# Altium project DEV_BOARD_FULL.PrjPcb (part 2 of 2)

## Sheet Sch_mcu_brd_pwr.SchDoc
size A
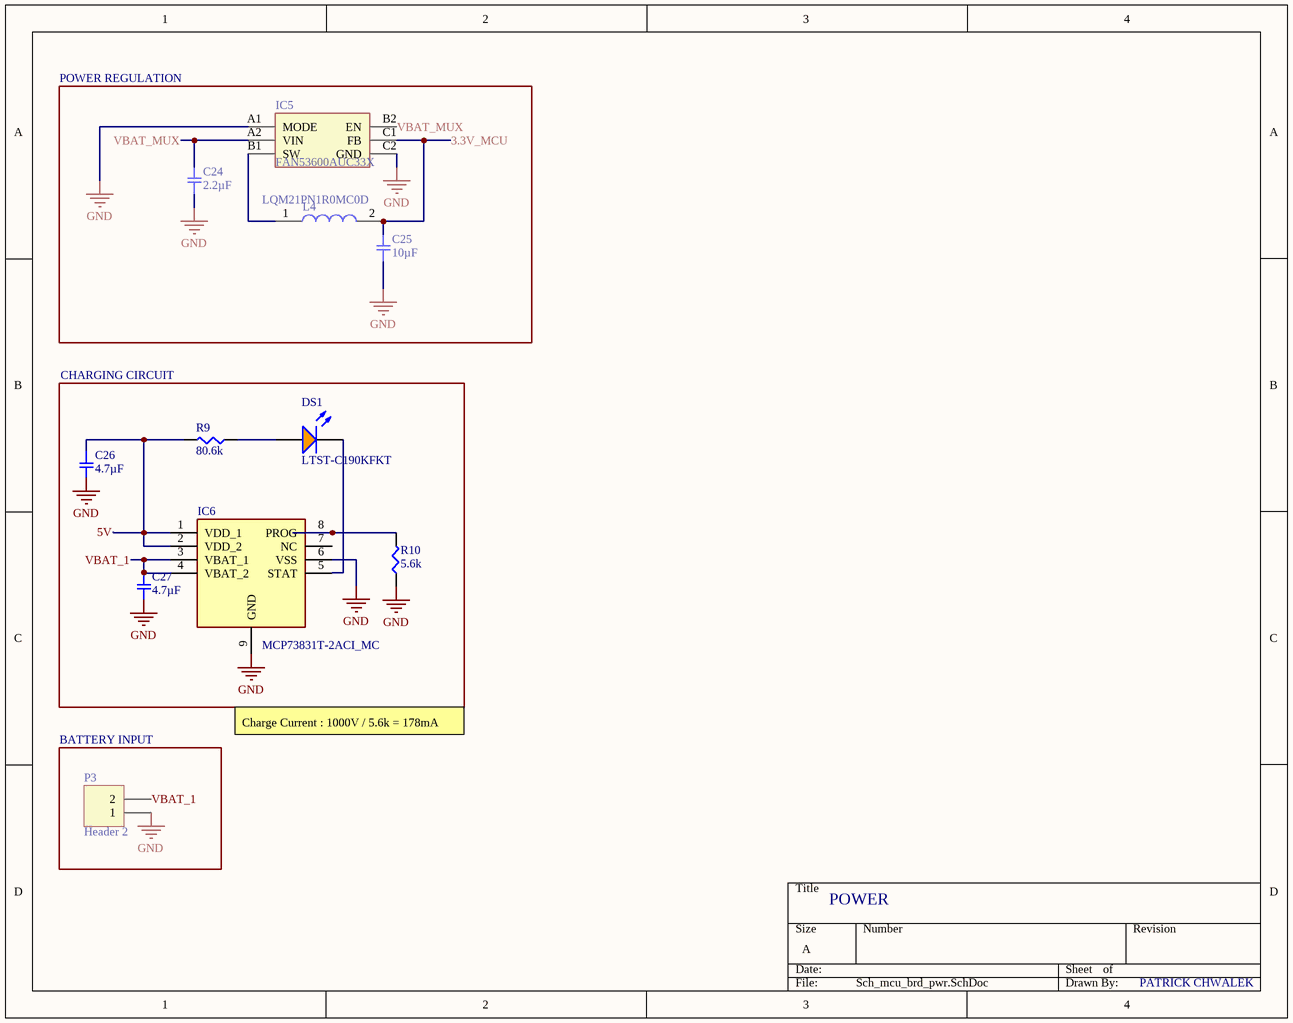
[diagram p7: Sch_mcu_brd_pwr.SchDoc]

### Parts
C24  2.2µF  [SMD-0402C]
C25  10µF  [SMD-0603C]
C26  4.7µF  [SMD-0402C]
C27  4.7µF  [SMD-0402C]
DS1  LTST-C190KFKT  [LTST-C190KFKT_V]
IC5  FAN53600AUC33X  [BGA6C40P2X3_86X116X62]
IC6  MCP73831T-2ACI_MC  [SON50P300X200X100-9N-D]
L4  LQM21PN1R0MC0D  [INDC2012X55N]
P3  Header 2  [HDR1X2]
R9  80.6k  [SMD-0402-RES]
R10  5.6k  [SMD-0402-RES]

### Blocks framed on the sheet
POWER REGULATION: C24 C25 IC5 L4
CHARGING CIRCUIT: C26 C27 DS1 IC6 R9 R10
BATTERY INPUT: P3

### Nets
3.3V_MCU: C25.2 IC5.C1(FB) L4.2
GND: C24.1 C25.1 C26.2 C27.2 IC5.A1(MODE) IC5.C2(GND) IC6.6(VSS) IC6.9(GND) P3.1 R10.1
5V: C26.1 IC6.1(VDD_1) IC6.2(VDD_2) R9.2
VBAT_1: C27.1 IC6.3(VBAT_1) IC6.4(VBAT_2) P3.2
VBAT_MUX: C24.2 IC5.A2(VIN) IC5.B2(EN)
NetDS1_1: DS1.1(A) R9.1
NetDS1_2: DS1.2(K) IC6.5(STAT)
NetIC5_B1: IC5.B1(SW) L4.1
NetIC6_8: IC6.8(PROG) R10.2

Not connected (* = marked no-connect by the designer): IC6 7(NC)

### Notes on the sheet
- Charge Current : 1000V / 5.6k = 178mA
- POWER
- PATRICK CHWALEK

### Library data of the parts
C24 = GRM155R60J225ME15D: CAP CER 2.2UF 6.3V X5R 0402; Manufacturer: Murata Electronics North America; Factory Stock: 0; Unit Price (USD): 0.15; Minimum Quantity: 1; Tolerance: ±20%; Datasheets: http://www.murata.com/~/media/webrenewal/support/library/catalog/products/capacitor/mlcc/c02e.pdf; Image: //media.digikey.com/Renders/Murata%20Renders/ZRB-SERIES-0402.jpg; Digi-Key Part Number: 490-4519-1-ND; Part Number: GRM155R60J225ME15D; Quantity Available: 911621; @ qty: 0; Packaging: Cut Tape (CT); Series: GRM; Part Status: Active; Value: 2.2µF; Voltage: 6.3V; Temperature Coefficient: X5R; Operating Temperature: -55°C ~ 85°C; Features: Derating Recommended; Ratings: -; Applications: General Purpose; Mounting Type: Surface Mount, MLCC; Package / Case: 0402 (1005 Metric); Size / Dimension: 0.039" L x 0.020" W (1.00mm x 0.50mm); Height - Seated (Max): -; Thickness (Max): 0.022" (0.55mm); Lead Spacing: -; Lead Style: -
C25 = GRM188R60J106ME47D: CAP CER 10UF 6.3V X5R 0603; Manufacturer: Murata Electronics North America; Factory Stock: 0; Unit Price (USD): 0.15; Minimum Quantity: 1; Tolerance: ±20%; Datasheets: http://www.murata.com/~/media/webrenewal/support/library/catalog/products/capacitor/mlcc/c02e.pdf; Image: //media.digikey.com/Renders/Murata%20Renders/ZRB-SERIES-0402.jpg; Digi-Key Part Number: 490-3896-1-ND; Part Number: GRM188R60J106ME47D; Quantity Available: 1578882; @ qty: 0; Packaging: Cut Tape (CT); Series: GRM; Part Status: Active; Value: 10µF; Voltage: 6.3V; Temperature Coefficient: X5R; Operating Temperature: -55°C ~ 85°C; Features: -; Ratings: -; Applications: General Purpose; Mounting Type: Surface Mount, MLCC; Package / Case: 0603 (1608 Metric); Size / Dimension: 0.063" L x 0.031" W (1.60mm x 0.80mm); Height - Seated (Max): -; Thickness (Max): 0.035" (0.90mm); Lead Spacing: -; Lead Style: -
C26 C27 = GRM153R60G475ME15D: CAP CER 4.7UF 4V X5R 0402; Manufacturer: Murata Electronics North America; Factory Stock: 0; Unit Price (USD): 0.27; Minimum Quantity: 1; Tolerance: ±20%; Datasheets: http://psearch.en.murata.com/capacitor/product/GRM153R60G475ME15%23.pdf; Image: //media.digikey.com/Renders/Murata%20Renders/ZRB-SERIES-0402.jpg; Digi-Key Part Number: 490-13231-1-ND; Part Number: GRM153R60G475ME15D; Quantity Available: 9100; @ qty: 0; Packaging: Cut Tape (CT); Series: GRM; Part Status: Active; Value: 4.7µF; Voltage: 4V; Temperature Coefficient: X5R; Operating Temperature: -55°C ~ 85°C; Features: -; Ratings: -; Applications: General Purpose; Mounting Type: Surface Mount, MLCC; Package / Case: 0402 (1005 Metric); Size / Dimension: 0.039" L x 0.020" W (1.00mm x 0.50mm); Height - Seated (Max): -; Thickness (Max): 0.013" (0.33mm); Lead Spacing: -; Lead Style: -
DS1 = CMP-1674-00008-1: LED Uni-Color Orange, 75 mW, 30 mA, -35 to 85 degC, 2-Pin SMD, RoHS, Tape and Reel; Resistance: 47 kohm; Power Rating: 100 mW; Case\Package: 0603; Tolerance: 1%; Voltage Rating (DC): 50 V; ComponentLink2URL: http://optoelectronics.liteon.com/upload/download/DS-22-99-0186/S_110_LTST-C190KFKT.pdf; Mount: Surface Mount; Pins: 2; Package Quantity: 5000; Max Operating Temperature: 155 degC; RoHSCompliant: true; PackageDescription: 2-Pin Surface Mount Device, Body 1.6 x 0.8 mm; Case Code (Metric): 1608; PackageReference: C190KFKT; Height: 0.45 mm; ComponentLink2Description: Datasheet; Min Operating Temperature: -55 degC; DatasheetVersion: Rev. I, 09/2011; Packaging: Tape and Reel; ComponentLink1Description: Manufacturer URL; ComponentLink1URL: http://www.us.liteon.com/; Voltage Rating: 50 V; Case Code (Imperial): 0603; Length: 1.6 mm; Width: 0.8 mm; REACH SVHC: No SVHC
IC5 = FAN53600AUC33X: Integrated Circuit; Manufacturer_Name: Fairchild Semiconductor; Datasheet Link: https://www.onsemi.com/pub/Collateral/FAN53610-D.pdf; Height: 0.625mm; Manufacturer_Part_Number: FAN53600AUC33X; Mouser Part Number: 512-FAN53600AUC33X; Mouser Price/Stock: https://www.mouser.com/Search/Refine.aspx?Keyword=512-FAN53600AUC33X
IC6 = MCP73831T-2ACI_MC: Integrated Circuit; Manufacturer_Name: Microchip; Manufacturer_Part_Number: MCP73831T-2ACI/MC; Allied_Number: 70452042; Datasheet Link: http://ww1.microchip.com/downloads/en/DeviceDoc/20001984g.pdf; Height: 1mm; Mouser Part Number: 579-MCP73831T-2ACIMC; Mouser Price/Stock: https://www.mouser.com/Search/Refine.aspx?Keyword=579-MCP73831T-2ACIMC; Allied Price/Stock: https://www.alliedelec.com/microchiptechnologyinc-mcp73831t-2aci-mc/70452042/
L4 = LQM21PN1R0MC0D: Inductor; Manufacturer_Name: Murata Electronics; Datasheet Link: https://componentsearchengine.com/Datasheets/2/LQM21PN1R0MC0D.pdf; Height: 0.55mm; Manufacturer_Part_Number: LQM21PN1R0MC0D; Mouser Part Number: 81-LQM21PN1R0MC0D; Mouser Price/Stock: https://www.mouser.com/Search/Refine.aspx?Keyword=81-LQM21PN1R0MC0D; RS Part Number: 7926388; RS Price/Stock: https://uk.rs-online.com/web/p/products/7926388
P3 = Header 2: Header, 2-Pin; LatestRevisionDate: 17-Jul-2002; LatestRevisionNote: Re-released for DXP Platform.; Publisher: Altium Limited
R9 = ERJ-2RKF8062X: RES SMD 80.6K OHM 1% 1/10W 0402; Manufacturer: Panasonic Electronic Components; Factory Stock: 0; Unit Price (USD): 0.00496; @ qty: 1500; Minimum Quantity: 1; Power (Watts): 0.1W, 1/10W; Temperature Coefficient: ±100ppm/°C; Part Number: ERJ-2RKF8062X; Datasheets: http://industrial.panasonic.com/www-cgi/jvcr13pz.cgi?E+PZ+3+AOA0002+ERJ2RKF8062X+7+WW; Image: //media.digikey.com/Photos/Panasonic%20Photos/ERJ-PA2-Series.jpg; Digi-Key Part Number: P80.6KLCT-ND; Quantity Available: 91747; Packaging: Cut Tape (CT); Series: ERJ; Part Status: Active; Value: 80.6k; Tolerance: ±1%; Composition: Thick Film; Features: Automotive AEC-Q200; Operating Temperature: -55°C ~ 155°C; Package / Case: 0402 (1005 Metric); Supplier Device Package: 0402; Size / Dimension: 0.039" L x 0.020" W (1.00mm x 0.50mm); Height - Seated (Max): 0.016" (0.40mm); Number of Terminations: 2; Failure Rate: -
R10 = ERJ-2GEJ562X: RES SMD 5.6K OHM 5% 1/10W 0402; Manufacturer: Panasonic Electronic Components; Factory Stock: 0; Unit Price (USD): 0.00350; @ qty: 1500; Minimum Quantity: 1; Power (Watts): 0.1W, 1/10W; Temperature Coefficient: ±200ppm/°C; Part Number: ERJ-2GEJ562X; Datasheets: http://industrial.panasonic.com/www-cgi/jvcr13pz.cgi?E+PZ+3+AOA0001+ERJ2GEJ562X+7+WW; Image: //media.digikey.com/Photos/Panasonic%20Photos/ERJ-PA2-Series.jpg; Digi-Key Part Number: P5.6KJCT-ND; Quantity Available: 212112; Packaging: Cut Tape (CT); Series: ERJ; Part Status: Active; Value: 5.6k; Tolerance: ±5%; Composition: Thick Film; Features: Automotive AEC-Q200; Operating Temperature: -55°C ~ 155°C; Package / Case: 0402 (1005 Metric); Supplier Device Package: 0402; Size / Dimension: 0.039" L x 0.020" W (1.00mm x 0.50mm); Height - Seated (Max): 0.016" (0.40mm); Number of Terminations: 2; Failure Rate: -

## Sheet Sch_mcu_brd_external_connectors.SchDoc
size A
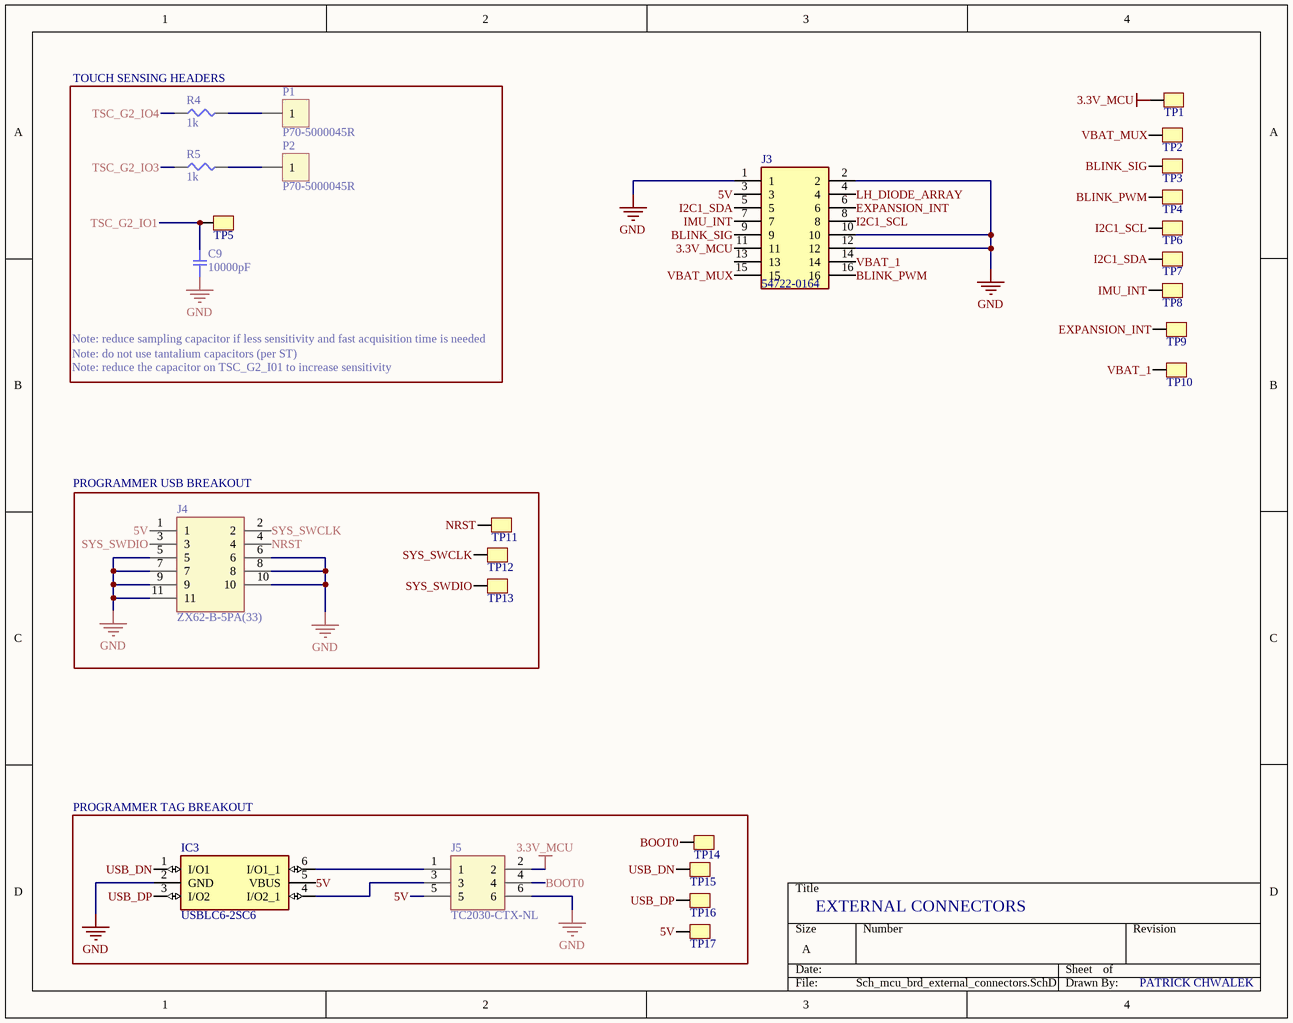
[diagram p8: Sch_mcu_brd_external_connectors.SchDoc]

### Parts
C9  10000pF  [SMD-0402C]
IC3  USBLC6-2SC6  [SOT95P280X145-6N]
J3  54722-0164  [54722-0164]
J4  ZX62-B-5PA(33)  [ZX62B5PA33]
J5  TC2030-CTX-NL  [TC2030MCPNL10]
P1  P70-5000045R  [P70-5000045R]
P2  P70-5000045R  [P70-5000045R]
R4  1k  [SMD-0402-RES]
R5  1k  [SMD-0402-RES]
TP1  TestPoint  [TestPoint_0.4mm]  (value not drawn)
TP2  TestPoint  [TestPoint_0.4mm]  (value not drawn)
TP3  TestPoint  [TestPoint_0.4mm]  (value not drawn)
TP4  TestPoint  [TestPoint_0.4mm]  (value not drawn)
TP5  TestPoint  [TestPoint_0.4mm]  (value not drawn)
TP6  TestPoint  [TestPoint_0.4mm]  (value not drawn)
TP7  TestPoint  [TestPoint_0.4mm]  (value not drawn)
TP8  TestPoint  [TestPoint_0.4mm]  (value not drawn)
TP9  TestPoint  [TestPoint_0.4mm]  (value not drawn)
TP10  TestPoint  [TestPoint_0.4mm]  (value not drawn)
TP11  TestPoint  [TestPoint_0.4mm]  (value not drawn)
TP12  TestPoint  [TestPoint_0.4mm]  (value not drawn)
TP13  TestPoint  [TestPoint_0.4mm]  (value not drawn)
TP14  TestPoint  [TestPoint_0.4mm]  (value not drawn)
TP15  TestPoint  [TestPoint_0.4mm]  (value not drawn)
TP16  TestPoint  [TestPoint_0.4mm]  (value not drawn)
TP17  TestPoint  [TestPoint_0.4mm]  (value not drawn)

### Blocks framed on the sheet
PROGRAMMER USB BREAKOUT: J4 TP11-TP13
PROGRAMMER TAG BREAKOUT: IC3 J5 TP14-TP17

### Nets
3.3V_MCU: J3.11 J5.2 TP1.1
GND: C9.1 IC3.2(GND) J3.1 J3.2 J3.10 J3.12 J4.5 J4.6 J4.7 J4.8 J4.9 J4.10 J4.11 J5.6
5V: IC3.5(VBUS) J3.3 J4.1 J5.5 TP17.1
BLINK_PWM: J3.16 TP4.1
BLINK_SIG: J3.9 TP3.1
BOOT0: J5.4 TP14.1
EXPANSION_INT: J3.6 TP9.1
I2C1_SCL: J3.8 TP6.1
I2C1_SDA: J3.5 TP7.1
IMU_INT: J3.7 TP8.1
LH_DIODE_ARRAY: J3.4
NRST: J4.4 TP11.1
SYS_SWCLK: J4.2 TP12.1
SYS_SWDIO: J4.3 TP13.1
TSC_G2_IO1: C9.2 TP5.1
TSC_G2_IO3: R5.1
TSC_G2_IO4: R4.1
USB_DN: IC3.1(I/O1) TP15.1
USB_DP: IC3.3(I/O2) TP16.1
VBAT_1: J3.14 TP10.1
VBAT_MUX: J3.15 TP2.1
NetIC3_4: IC3.4(I/O2_1) J5.3
NetIC3_6: IC3.6(I/O1_1) J5.1
NetP1_1: P1.1 R4.2
NetP2_1: P2.1 R5.2

Not connected (* = marked no-connect by the designer): J3 13

### Notes on the sheet
- (near R4) TOUCH SENSING HEADERS
- Note: reduce sampling capacitor if less sensitivity and fast acquisition time is needed
- Note: do not use tantalium capacitors (per ST)
- Note: reduce the capacitor on TSC_G2_I01 to increase sensitivity
- EXTERNAL CONNECTORS
- PATRICK CHWALEK

### Library data of the parts
C9 = GCM155R71H103KA55D: CAP CER 10000PF 50V X7R 0402; Manufacturer: Murata Electronics North America; Factory Stock: 0; Unit Price (USD): 0.1; Minimum Quantity: 1; Tolerance: ±10%; Datasheets: http://www.murata.com/~/media/webrenewal/support/library/catalog/products/capacitor/mlcc/c03e.ashx; Image: //media.digikey.com/Renders/Murata%20Renders/ZRB-SERIES-0402.jpg; Digi-Key Part Number: 490-4762-1-ND; Part Number: GCM155R71H103KA55D; Quantity Available: 650067; @ qty: 0; Packaging: Cut Tape (CT); Series: GCM; Part Status: Active; Value: 10000pF; Voltage: 50V; Temperature Coefficient: X7R; Operating Temperature: -55°C ~ 125°C; Features: -; Ratings: AEC-Q200; Applications: Automotive; Mounting Type: Surface Mount, MLCC; Package / Case: 0402 (1005 Metric); Size / Dimension: 0.039" L x 0.020" W (1.00mm x 0.50mm); Height - Seated (Max): -; Thickness (Max): 0.022" (0.55mm); Lead Spacing: -; Lead Style: -
IC3 = USBLC6-2SC6: Integrated Circuit; Manufacturer_Name: STMicroelectronics; Allied_Number: 70389689; Datasheet Link: http://www.st.com/st-web-ui/static/active/en/resource/technical/document/datasheet/CD00050750.pdf; Height: 1.45mm; Manufacturer_Part_Number: USBLC6-2SC6; Mouser Part Number: 511-USBLC6-2SC6; Mouser Price/Stock: https://www.mouser.com/Search/Refine.aspx?Keyword=511-USBLC6-2SC6; RS Part Number: 9206266; RS Price/Stock: https://uk.rs-online.com/web/p/products/9206266; Allied Price/Stock: http://www.alliedelec.com/stmicroelectronics-usblc6-2sc6/70389689/
J3 = 54722-0164: Connector; Manufacturer_Name: Molex; Datasheet Link: http://www.molex.com/webdocs/datasheets/pdf/en-us//0547220164_PCB_RECEPTACLES.pdf; Manufacturer_Part_Number: 54722-0164; Mouser Part Number: 538-54722-0164; Mouser Price/Stock: https://www.mouser.com/Search/Refine.aspx?Keyword=538-54722-0164; RS Part Number: 7206511; RS Price/Stock: https://uk.rs-online.com/web/p/products/7206511
J4 = ZX62-B-5PA(33): Connector; Manufacturer_Name: Hirose; Datasheet Link: http://www.mouser.com/ds/2/185/ZX_catalog-939768.pdf; Height: 2.8mm; Manufacturer_Part_Number: ZX62-B-5PA(33); Mouser Part Number: 798-ZX62-B-5PA33; Mouser Price/Stock: https://www.mouser.com/Search/Refine.aspx?Keyword=798-ZX62-B-5PA33; RS Part Number: 1362267; RS Price/Stock: http://uk.rs-online.com/web/p/products/1362267
J5 = TC2030-CTX-NL: Connector; Manufacturer_Name: Tag Connect; Datasheet Link: http://www.tag-connect.com/Materials/TC2030-CTX.pdf; Height: 18mm; Manufacturer_Part_Number: TC2030-CTX-NL
R4 R5 = ERJ-2GEJ102X: RES SMD 1K OHM 5% 1/10W 0402; Manufacturer: Panasonic Electronic Components; Factory Stock: 0; Unit Price (USD): 0.00350; @ qty: 1500; Minimum Quantity: 1; Power (Watts): 0.1W, 1/10W; Temperature Coefficient: ±200ppm/°C; Part Number: ERJ-2GEJ102X; Datasheets: http://industrial.panasonic.com/www-cgi/jvcr13pz.cgi?E+PZ+3+AOA0001+ERJ2GEJ102X+7+WW; Image: //media.digikey.com/Photos/Panasonic%20Photos/ERJ-PA2-Series.jpg; Digi-Key Part Number: P1.0KJCT-ND; Quantity Available: 1939857; Packaging: Cut Tape (CT); Series: ERJ; Part Status: Active; Value: 1k; Tolerance: ±5%; Composition: Thick Film; Features: Automotive AEC-Q200; Operating Temperature: -55°C ~ 155°C; Package / Case: 0402 (1005 Metric); Supplier Device Package: 0402; Size / Dimension: 0.039" L x 0.020" W (1.00mm x 0.50mm); Height - Seated (Max): 0.016" (0.40mm); Number of Terminations: 2; Failure Rate: -

## Sheet Sch_mcu_brd_mcu.SchDoc
size A
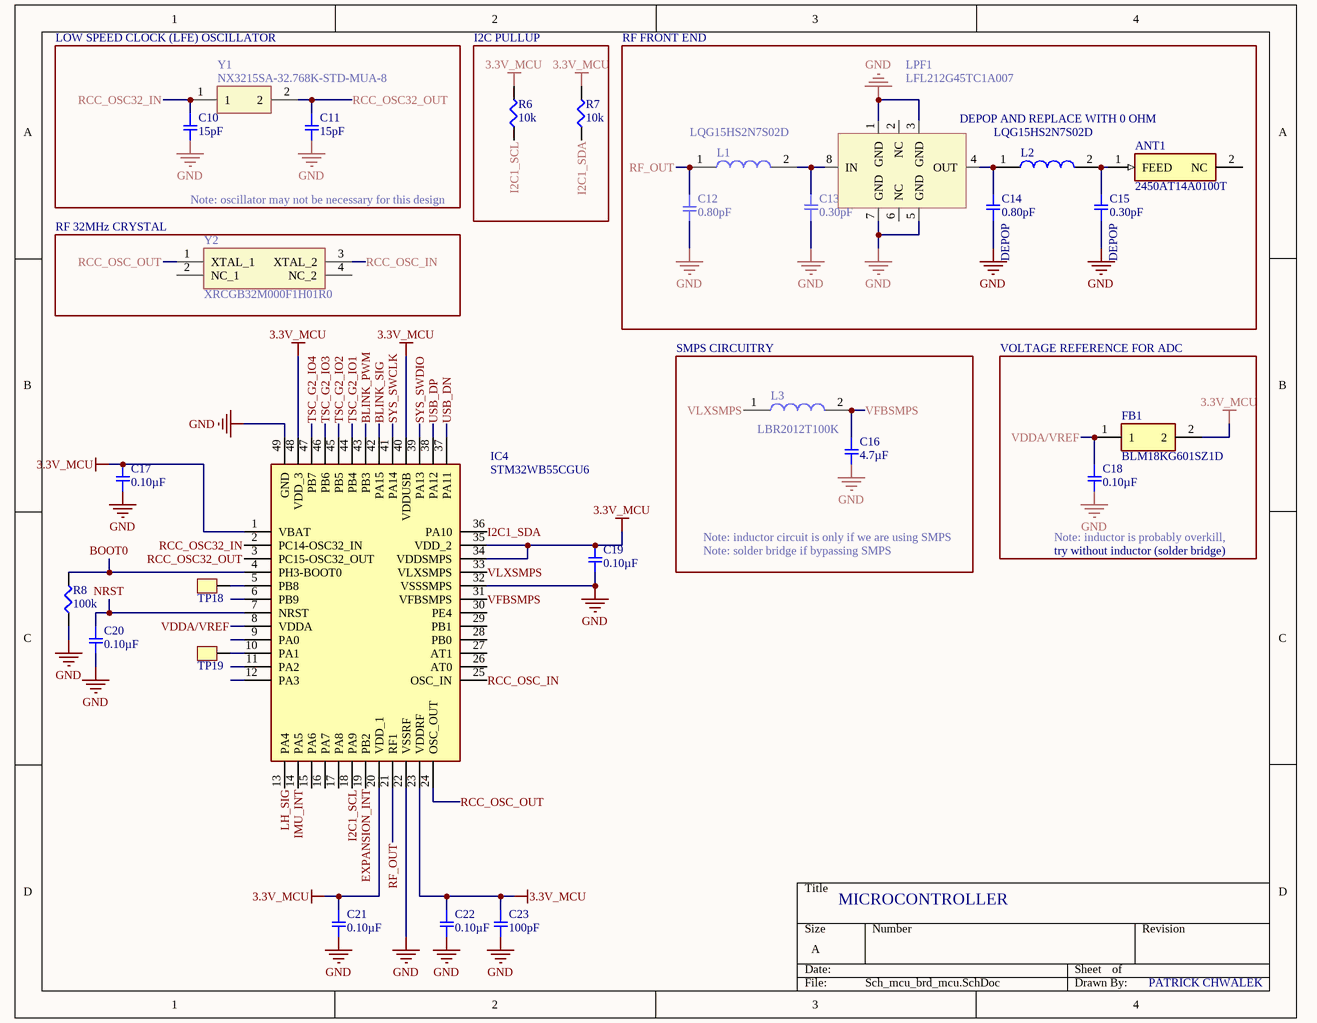
[diagram p9: Sch_mcu_brd_mcu.SchDoc]

### Parts
ANT1  2450AT14A0100T  [ANTC1608X40N]
C10  15pF  [SMD-0402C]
C11  15pF  [SMD-0402C]
C12  0.80pF  [SMD-0402C]
C13  0.30pF  [SMD-0402C]
C14  0.80pF  [SMD-0402C]
C15  0.30pF  [SMD-0402C]
C16  4.7µF  [SMD-0402C]
C17  0.10µF  [SMD-0402C]
C18  0.10µF  [SMD-0402C]
C19  0.10µF  [SMD-0402C]
C20  0.10µF  [SMD-0402C]
C21  0.10µF  [SMD-0402C]
C22  0.10µF  [SMD-0402C]
C23  100pF  [SMD-0402C]
FB1  BLM18KG601SZ1D  [BEADC1608X95N]
IC4  STM32WB55CGU6  [QFN50P700X700X65-49N-D]
L1  LQG15HS2N7S02D  [INDC1005X55N]
L2  LQG15HS2N7S02D  [INDC1005X55N]
L3  LBR2012T100K  [INDC2012X145N]
LPF1  LFL212G45TC1A007  [LFL212G45TC1A007]
R6  10k  [SMD-0402-RES]
R7  10k  [SMD-0402-RES]
R8  100k  [SMD-0402-RES]
TP18  TestPoint  [TestPoint_0.4mm]  (value not drawn)
TP19  TestPoint  [TestPoint_0.4mm]  (value not drawn)
Y1  NX3215SA-32.768K-STD-MUA-8  [NX3215SA]
Y2  XRCGB32M000F1H01R0  [XRCGB32M000F1H01R0]

### Blocks framed on the sheet
I2C PULLUP: R6 R7
RF 32MHz CRYSTAL: Y2

### Nets
3.3V_MCU: C17.1 C19.1 C21.1 C22.1 C23.1 FB1.2 IC4.1(VBAT) IC4.20(VDD_1) IC4.23(VDDRF) IC4.34(VDDSMPS) IC4.35(VDD_2) IC4.40(VDDUSB) IC4.48(VDD_3) R6.2 R7.2
GND: C10.2 C11.2 C12.2 C13.1 C14.1 C15.1 C16.2 C17.2 C18.2 C19.2 C20.2 C21.2 C22.2 C23.2 IC4.22(VSSRF) IC4.32(VSSSMPS) IC4.49(GND) LPF1.1(GND) LPF1.3(GND) LPF1.5(GND) LPF1.7(GND) R8.1
BLINK_PWM: IC4.43(PB3)
BLINK_SIG: IC4.42(PA15)
BOOT0: IC4.4(PH3-BOOT0) R8.2
EXPANSION_INT: IC4.19(PB2)
I2C1_SCL: IC4.18(PA9) R6.1
I2C1_SDA: IC4.36(PA10) R7.1
IMU_INT: IC4.14(PA5)
LH_SIG: IC4.13(PA4)
NRST: C20.1 IC4.7(NRST)
RCC_OSC32_IN: C10.1 IC4.2(PC14-OSC32_IN) Y1.1
RCC_OSC32_OUT: C11.1 IC4.3(PC15-OSC32_OUT) Y1.2
RCC_OSC_IN: IC4.25(OSC_IN) Y2.3(XTAL_2)
RCC_OSC_OUT: IC4.24(OSC_OUT) Y2.1(XTAL_1)
RF_OUT: C12.1 IC4.21(RF1) L1.1
SYS_SWCLK: IC4.41(PA14)
SYS_SWDIO: IC4.39(PA13)
TSC_G2_IO1: IC4.44(PB4)
TSC_G2_IO2: IC4.45(PB5)
TSC_G2_IO3: IC4.46(PB6)
TSC_G2_IO4: IC4.47(PB7)
USB_DN: IC4.37(PA11)
USB_DP: IC4.38(PA12)
VDDA/VREF: C18.1 FB1.1 IC4.8(VDDA)
VFBSMPS: C16.1 IC4.31(VFBSMPS) L3.2
VLXSMPS: IC4.33(VLXSMPS) L3.1
NetANT1_1: ANT1.1(FEED) C15.2 L2.2
NetC13_2: C13.2 L1.2 LPF1.8(IN)
NetC14_2: C14.2 L2.1 LPF1.4(OUT)
NetIC4_5: IC4.5(PB8) TP18.1
NetIC4_10: IC4.10(PA1) TP19.1

Not connected (* = marked no-connect by the designer): ANT1 2(NC); IC4 6(PB9) 9(PA0) 11(PA2) 12(PA3) 15(PA6) 16(PA7) 17(PA8) 26(AT0) 27(AT1) 28(PB0) 29(PB1) 30(PE4); LPF1 2(NC) 6(NC); Y2 2(NC_1) 4(NC_2)

### Notes on the sheet
- LOW SPEED CLOCK (LFE) OSCILLATOR
- RF FRONT END
- (near LPF1) DEPOP AND REPLACE WITH 0 OHM
- Note: oscillator may not be necessary for this design
- (near C14) DEPOP
- (near C15) DEPOP
- SMPS CIRCUITRY
- VOLTAGE REFERENCE FOR ADC
- Note: inductor circuit is only if we are using SMPS
- Note: solder bridge if bypassing SMPS
- (near C18) Note: inductor is probably overkill,
- try without inductor (solder bridge)
- MICROCONTROLLER
- PATRICK CHWALEK

### Library data of the parts
ANT1 = 2450AT14A0100T: Antenna; Manufacturer_Name: JOHANSON TECHNOLOGY; Datasheet Link: https://www.johansontechnology.com/datasheets/2450AT14A0100/2450AT14A0100.pdf; Height: 0.4mm; Manufacturer_Part_Number: 2450AT14A0100T; Mouser Part Number: 609-2450AT14A0100T; Mouser Price/Stock: https://www.mouser.com/Search/Refine.aspx?Keyword=609-2450AT14A0100T
C10 C11 = GCM1555C1H150JA16D: CAP CER 15PF 50V NP0 0402; Manufacturer: Murata Electronics North America; Factory Stock: 0; Unit Price (USD): 0.1; Minimum Quantity: 1; Tolerance: ±5%; Temperature Coefficient: C0G, NP0; Datasheets: http://www.murata.com/~/media/webrenewal/support/library/catalog/products/capacitor/mlcc/c03e.ashx; Image: //media.digikey.com/Renders/Murata%20Renders/ZRB-SERIES-0402.jpg; Digi-Key Part Number: 490-11147-1-ND; Part Number: GCM1555C1H150JA16D; Quantity Available: 6185; @ qty: 0; Packaging: Cut Tape (CT); Series: GCM; Part Status: Active; Value: 15pF; Voltage: 50V; Operating Temperature: -55°C ~ 125°C; Features: -; Ratings: AEC-Q200; Applications: Automotive; Mounting Type: Surface Mount, MLCC; Package / Case: 0402 (1005 Metric); Size / Dimension: 0.039" L x 0.020" W (1.00mm x 0.50mm); Height - Seated (Max): -; Thickness (Max): 0.022" (0.55mm); Lead Spacing: -; Lead Style: -
C12 C14 = GRM1555C1HR80BA01D: CAP CER 0.8PF 50V NP0 0402; Manufacturer: Murata Electronics North America; Factory Stock: 0; Unit Price (USD): 0.1; Minimum Quantity: 1; Tolerance: ±0.1pF; Temperature Coefficient: C0G, NP0; Datasheets: http://www.murata.com/~/media/webrenewal/support/library/catalog/products/capacitor/mlcc/c02e.pdf; Image: //media.digikey.com/Renders/Murata%20Renders/ZRB-SERIES-0402.jpg; Digi-Key Part Number: 490-6269-1-ND; Part Number: GRM1555C1HR80BA01D; Quantity Available: 38847; @ qty: 0; Packaging: Cut Tape (CT); Series: GRM; Part Status: Active; Value: 0.80pF; Voltage: 50V; Operating Temperature: -55°C ~ 125°C; Features: -; Ratings: -; Applications: General Purpose; Mounting Type: Surface Mount, MLCC; Package / Case: 0402 (1005 Metric); Size / Dimension: 0.039" L x 0.020" W (1.00mm x 0.50mm); Height - Seated (Max): -; Thickness (Max): 0.022" (0.55mm); Lead Spacing: -; Lead Style: -
C13 C15 = GRM1555C1HR30WA01D: CAP CER 0.3PF 50V NP0 0402; Manufacturer: Murata Electronics North America; Factory Stock: 0; Unit Price (USD): 0.16; Minimum Quantity: 1; Tolerance: ±0.05pF; Temperature Coefficient: C0G, NP0; Datasheets: http://www.murata.com/~/media/webrenewal/support/library/catalog/products/capacitor/mlcc/c02e.pdf; Image: //media.digikey.com/Renders/Murata%20Renders/ZRB-SERIES-0402.jpg; Digi-Key Part Number: 490-6261-1-ND; Part Number: GRM1555C1HR30WA01D; Quantity Available: 61475; @ qty: 0; Packaging: Cut Tape (CT); Series: GRM; Part Status: Active; Value: 0.30pF; Voltage: 50V; Operating Temperature: -55°C ~ 125°C; Features: -; Ratings: -; Applications: General Purpose; Mounting Type: Surface Mount, MLCC; Package / Case: 0402 (1005 Metric); Size / Dimension: 0.039" L x 0.020" W (1.00mm x 0.50mm); Height - Seated (Max): -; Thickness (Max): 0.022" (0.55mm); Lead Spacing: -; Lead Style: -
C16 = GRM153R60G475ME15D: as C26 on sheet Sch_mcu_brd_pwr; Datasheets: http://psearch.en.murata.com/capacitor/product/GRM153R60G475ME15%23.pdf; Image: //media.digikey.com/Renders/Murata%20Renders/ZRB-SERIES-0402.jpg; Digi-Key Part Number: 490-13231-1-ND; Part Number: GRM153R60G475ME15D; Quantity Available: 9100; @ qty: 0; Packaging: Cut Tape (CT); Series: GRM; Part Status: Active; Value: 4.7µF; Voltage: 4V; Temperature Coefficient: X5R; Operating Temperature: -55°C ~ 85°C; Features: -; Ratings: -; Applications: General Purpose; Mounting Type: Surface Mount, MLCC; Package / Case: 0402 (1005 Metric); Size / Dimension: 0.039" L x 0.020" W (1.00mm x 0.50mm); Height - Seated (Max): -; Thickness (Max): 0.013" (0.33mm); Lead Spacing: -; Lead Style: -
C17-C22 = GCM155R71C104KA55D: CAP CER 0.1UF 16V X7R 0402; Manufacturer: Murata Electronics North America; Factory Stock: 0; Unit Price (USD): 0.1; Minimum Quantity: 1; Tolerance: ±10%; Datasheets: http://www.murata.com/~/media/webrenewal/support/library/catalog/products/capacitor/mlcc/c03e.ashx; Image: //media.digikey.com/Renders/Murata%20Renders/ZRB-SERIES-0402.jpg; Digi-Key Part Number: 490-4759-1-ND; Part Number: GCM155R71C104KA55D; Quantity Available: 734194; @ qty: 0; Packaging: Cut Tape (CT); Series: GCM; Part Status: Active; Value: 0.10µF; Voltage: 16V; Temperature Coefficient: X7R; Operating Temperature: -55°C ~ 125°C; Features: -; Ratings: AEC-Q200; Applications: Automotive; Mounting Type: Surface Mount, MLCC; Package / Case: 0402 (1005 Metric); Size / Dimension: 0.039" L x 0.020" W (1.00mm x 0.50mm); Height - Seated (Max): -; Thickness (Max): 0.022" (0.55mm); Lead Spacing: -; Lead Style: -
C23 = GCM1555C1H101JA16D: CAP CER 100PF 50V NP0 0402; Manufacturer: Murata Electronics North America; Factory Stock: 0; Unit Price (USD): 0.1; Minimum Quantity: 1; Tolerance: ±5%; Temperature Coefficient: C0G, NP0; Datasheets: http://www.murata.com/~/media/webrenewal/support/library/catalog/products/capacitor/mlcc/c03e.ashx; Image: //media.digikey.com/Renders/Murata%20Renders/ZRB-SERIES-0402.jpg; Digi-Key Part Number: 490-10669-1-ND; Part Number: GCM1555C1H101JA16D; Quantity Available: 61397; @ qty: 0; Packaging: Cut Tape (CT); Series: GCM; Part Status: Active; Value: 100pF; Voltage: 50V; Operating Temperature: -55°C ~ 125°C; Features: -; Ratings: AEC-Q200; Applications: Automotive; Mounting Type: Surface Mount, MLCC; Package / Case: 0402 (1005 Metric); Size / Dimension: 0.039" L x 0.020" W (1.00mm x 0.50mm); Height - Seated (Max): -; Thickness (Max): 0.022" (0.55mm); Lead Spacing: -; Lead Style: -
FB1 = BLM18KG601SZ1D: Ferrite Bead; Manufacturer_Name: Murata Electronics; Datasheet Link: http://www.murata.com/~/media/webrenewal/support/library/catalog/products/emc/emifil/c31e.ashx?la=en-gb; Height: 0.95mm; Manufacturer_Part_Number: BLM18KG601SZ1D; Mouser Part Number: 81-BLM18KG601SZ1D; Mouser Price/Stock: https://www.mouser.com/Search/Refine.aspx?Keyword=81-BLM18KG601SZ1D
IC4 = STM32WB55CGU6: Integrated Circuit; Manufacturer_Name: STMicroelectronics; Datasheet Link: https://www.st.com/en/microcontrollers/stm32wb55cg.html; Height: 0.65mm; Manufacturer_Part_Number: STM32WB55CGU6; Mouser Part Number: 511-STM32WB55CGU6; Mouser Price/Stock: https://www.mouser.com/Search/Refine.aspx?Keyword=511-STM32WB55CGU6
L1 L2 = LQG15HS2N7S02D: Inductor; Manufacturer_Name: Murata Electronics; Datasheet Link: https://www.arrow.com/en/products/lqg15hs2n7s02d/murata-manufacturing; Height: 0.55mm; Manufacturer_Part_Number: LQG15HS2N7S02D
L3 = LBR2012T100K: Inductor; Manufacturer_Name: TAIYO YUDEN; Datasheet Link: https://componentsearchengine.com/Datasheets/2/LBR2012T100K.pdf; Height: 1.45mm; Manufacturer_Part_Number: LBR2012T100K; Mouser Part Number: 963-LBR2012T100K; Mouser Price/Stock: https://www.mouser.com/Search/Refine.aspx?Keyword=963-LBR2012T100K
R6 R7 = ERJ-2GEJ103X: RES SMD 10K OHM 5% 1/10W 0402; Manufacturer: Panasonic Electronic Components; Factory Stock: 0; Unit Price (USD): 0.00350; @ qty: 1500; Minimum Quantity: 1; Power (Watts): 0.1W, 1/10W; Temperature Coefficient: ±200ppm/°C; Part Number: ERJ-2GEJ103X; Datasheets: http://industrial.panasonic.com/www-cgi/jvcr13pz.cgi?E+PZ+3+AOA0001+ERJ2GEJ103X+7+WW; Image: //media.digikey.com/Photos/Panasonic%20Photos/ERJ-PA2-Series.jpg; Digi-Key Part Number: P10KJCT-ND; Quantity Available: 2560215; Packaging: Cut Tape (CT); Series: ERJ; Part Status: Active; Value: 10k; Tolerance: ±5%; Composition: Thick Film; Features: Automotive AEC-Q200; Operating Temperature: -55°C ~ 155°C; Package / Case: 0402 (1005 Metric); Supplier Device Package: 0402; Size / Dimension: 0.039" L x 0.020" W (1.00mm x 0.50mm); Height - Seated (Max): 0.016" (0.40mm); Number of Terminations: 2; Failure Rate: -
R8 = ERJ-2RKF1003X: RES SMD 100K OHM 1% 1/10W 0402; Manufacturer: Panasonic Electronic Components; Factory Stock: 0; Unit Price (USD): 0.00496; @ qty: 1500; Minimum Quantity: 1; Power (Watts): 0.1W, 1/10W; Temperature Coefficient: ±100ppm/°C; Part Number: ERJ-2RKF1003X; Datasheets: http://industrial.panasonic.com/www-cgi/jvcr13pz.cgi?E+PZ+3+AOA0002+ERJ2RKF1003X+7+WW; Image: //media.digikey.com/Photos/Panasonic%20Photos/ERJ-PA2-Series.jpg; Digi-Key Part Number: P100KLCT-ND; Quantity Available: 2645965; Packaging: Cut Tape (CT); Series: ERJ; Part Status: Active; Value: 100k; Tolerance: ±1%; Composition: Thick Film; Features: Automotive AEC-Q200; Operating Temperature: -55°C ~ 155°C; Package / Case: 0402 (1005 Metric); Supplier Device Package: 0402; Size / Dimension: 0.039" L x 0.020" W (1.00mm x 0.50mm); Height - Seated (Max): 0.016" (0.40mm); Number of Terminations: 2; Failure Rate: -
Y1 = NX3215SA-32.768K-STD-MUA-8: Crystal or Oscillator; Manufacturer_Name: NDK; Datasheet Link: http://www.ndk.com/images/products/catalog/c_NX3215SA-STD-MUA-14_e.pdf; Manufacturer_Part_Number: NX3215SA-32.768K-STD-MUA-8; Mouser Part Number: 344-NX3215SA32768K8; Mouser Price/Stock: https://www.mouser.com/Search/Refine.aspx?Keyword=344-NX3215SA32768K8
Y2 = XRCGB32M000F1H01R0: Crystal or Oscillator; Manufacturer_Name: Murata Electronics; Datasheet Link: https://www.murata.com/en-eu/products/productdetail?partno=XRCGB32M000F1H01R0; Height: 0.7mm; Manufacturer_Part_Number: XRCGB32M000F1H01R0; Mouser Part Number: 81-XRCGB32M000F1H01R; Mouser Price/Stock: https://www.mouser.com/Search/Refine.aspx?Keyword=81-XRCGB32M000F1H01R

## Nets that join several sheets
3.3V_MCU: Sch_front_led (J1.5), Sch_pwr_brd_pwr (H1.1), Sch_mcu_brd_sensors (C28.1 IC7.8), Sch_mcu_brd_pwr (C25.2 IC5.C1 L4.2), Sch_mcu_brd_external_connectors (J3.11 J5.2 TP1.1), Sch_mcu_brd_mcu (15 pins)
3.3V_PWR: Sch_front_led (J8.13), Sch_front (R1.2 R3.2), sch_pwr_brd_sensors (9 pins), Sch_pwr_brd_pwr_sys (6 pins), Sch_pwr_brd_MCU (10 pins)
GND: Sch_front_led (16 pins), Sch_front (6 pins), sch_pwr_brd_sensors (17 pins), Sch_pwr_brd_pwr_sys (21 pins), Sch_pwr_brd_pwr (H1.5 P4.1 TP39.1), Sch_pwr_brd_MCU (12 pins), Sch_mcu_brd_sensors (7 pins), Sch_mcu_brd_pwr (10 pins), Sch_mcu_brd_external_connectors (14 pins), Sch_mcu_brd_mcu (22 pins)
5V: Sch_front_led (J1.13 J2.14 J8.20), Sch_pwr_brd_pwr_sys (6 pins), Sch_pwr_brd_MCU (J6.5), Sch_mcu_brd_pwr (C26.1 IC6.1 IC6.2 R9.2), Sch_mcu_brd_external_connectors (5 pins)
ADC_ALERT: Sch_pwr_brd_pwr_sys (Y4.2), Sch_pwr_brd_MCU (IC8.10 TP25.1)
ANALOG_EXP_CONN: Sch_pwr_brd_pwr_sys (Y4.6), Sch_pwr_brd_pwr (H1.3), Sch_pwr_brd_MCU (IC8.9 TP27.1)
BLINK_PWM: Sch_front_led (J1.2 J8.11), Sch_front (CONN_2.4 U1.1), Sch_mcu_brd_external_connectors (J3.16 TP4.1), Sch_mcu_brd_mcu (IC4.43)
BLINK_SIG: Sch_front_led (J1.7 J8.1), Sch_front (CONN_2.2 R3.1 U1.3), Sch_mcu_brd_external_connectors (J3.9 TP3.1), Sch_mcu_brd_mcu (IC4.42)
BOOT0: Sch_pwr_brd_MCU (TP35.1), Sch_mcu_brd_external_connectors (J5.4 TP14.1), Sch_mcu_brd_mcu (IC4.4 R8.2)
CMOUT: Sch_front_led (J2.6 J8.19), Sch_front (CONN_1.2 U2.2), sch_pwr_brd_sensors (8 pins), Sch_pwr_brd_pwr_sys (J7.12 TP46.1)
EXPANSION_INT: Sch_front_led (J1.12 J2.11 J8.3), Sch_pwr_brd_pwr_sys (J7.5 TP43.1), Sch_pwr_brd_MCU (IC8.11), Sch_mcu_brd_external_connectors (J3.6 TP9.1), Sch_mcu_brd_mcu (IC4.19)
I2C1_SCL: Sch_front_led (J1.10 J2.9 J8.5), sch_pwr_brd_sensors (AC1.19), Sch_pwr_brd_pwr_sys (J7.7 TP41.1 Y4.10), Sch_pwr_brd_pwr (H1.2), Sch_pwr_brd_MCU (IC8.25 R15.1), Sch_mcu_brd_external_connectors (J3.8 TP6.1), Sch_mcu_brd_mcu (IC4.18 R6.1)
I2C1_SDA: Sch_front_led (J1.11 J2.12 J8.25), sch_pwr_brd_sensors (AC1.20), Sch_pwr_brd_pwr_sys (J7.6 TP49.1 Y4.9), Sch_pwr_brd_pwr (H1.4), Sch_pwr_brd_MCU (IC8.30 R16.1), Sch_mcu_brd_external_connectors (J3.5 TP7.1), Sch_mcu_brd_mcu (IC4.36 R7.1)
IMU_INT: Sch_front_led (J1.9 J2.10 J8.23), sch_pwr_brd_sensors (AC1.14), Sch_pwr_brd_pwr_sys (J7.8 TP48.1), Sch_pwr_brd_MCU (IC8.12), Sch_mcu_brd_external_connectors (J3.7 TP8.1), Sch_mcu_brd_mcu (IC4.14)
LH_DIODE_ARRAY: Sch_front_led (J1.14 J2.13 J8.7), Sch_front (D1.1), sch_pwr_brd_sensors (D3.1), Sch_pwr_brd_pwr_sys (J7.3 TP44.1), Sch_mcu_brd_sensors (5 pins), Sch_mcu_brd_external_connectors (J3.4)
LH_SIG: Sch_mcu_brd_sensors (IC7.7 R13.2 TP23.1), Sch_mcu_brd_mcu (IC4.13)
NRST: Sch_pwr_brd_MCU (TP32.1), Sch_mcu_brd_external_connectors (J4.4 TP11.1), Sch_mcu_brd_mcu (C20.1 IC4.7)
SPI3_MOSI: sch_pwr_brd_sensors (IC11.12), Sch_pwr_brd_MCU (IC8.28 TP36.1)
SPI3_SCLK: sch_pwr_brd_sensors (IC11.11), Sch_pwr_brd_MCU (IC8.26 TP38.1)
SYS_SWCLK: Sch_mcu_brd_external_connectors (J4.2 TP12.1), Sch_mcu_brd_mcu (IC4.41)
SYS_SWDIO: Sch_mcu_brd_external_connectors (J4.3 TP13.1), Sch_mcu_brd_mcu (IC4.39)
TP_AFE_OUT: sch_pwr_brd_sensors (C49.1 R23.2), Sch_pwr_brd_pwr_sys (Y4.4), Sch_pwr_brd_MCU (IC8.7 TP26.1)
TP_NOSE: Sch_front_led (J2.8 J8.21), Sch_front (CONN_1.3 U2.4), sch_pwr_brd_sensors (C44.2 IC11.1), Sch_pwr_brd_pwr_sys (J7.10 TP47.1)
TP_SS: sch_pwr_brd_sensors (IC11.10), Sch_pwr_brd_MCU (IC8.13)
TP_THERMISTOR: Sch_front_led (J2.7 J8.22), Sch_front (CONN_1.1 R1.1 U2.3), Sch_pwr_brd_pwr_sys (J7.9 TP40.1 Y4.5), Sch_pwr_brd_MCU (IC8.8)
TSC_G2_IO1: Sch_mcu_brd_external_connectors (C9.2 TP5.1), Sch_mcu_brd_mcu (IC4.44)
TSC_G2_IO3: Sch_mcu_brd_external_connectors (R5.1), Sch_mcu_brd_mcu (IC4.46)
TSC_G2_IO4: Sch_mcu_brd_external_connectors (R4.1), Sch_mcu_brd_mcu (IC4.47)
USB_DN: Sch_mcu_brd_external_connectors (IC3.1 TP15.1), Sch_mcu_brd_mcu (IC4.37)
USB_DP: Sch_mcu_brd_external_connectors (IC3.3 TP16.1), Sch_mcu_brd_mcu (IC4.38)
VBAT: Sch_front_led (J8.17), Sch_pwr_brd_pwr (Q1.3)
VBAT_1: Sch_front_led (J1.4 J2.3), Sch_pwr_brd_pwr_sys (C37.1 J7.13 PS1.8 TP42.1), Sch_mcu_brd_pwr (C27.1 IC6.3 IC6.4 P3.2), Sch_mcu_brd_external_connectors (J3.14 TP10.1)
VBAT_2: Sch_pwr_brd_pwr_sys (5 pins), Sch_pwr_brd_pwr (P4.2)
VBAT_MUX: Sch_front_led (J1.1 J2.2), Sch_pwr_brd_pwr_sys (7 pins), Sch_mcu_brd_pwr (C24.2 IC5.A2 IC5.B2), Sch_mcu_brd_external_connectors (J3.15 TP2.1)